# Altium schematic sheet LTC1562 8th order 2 resistors per pin.SchDoc
size B; SheetNumber: 1; SheetTotal: 2
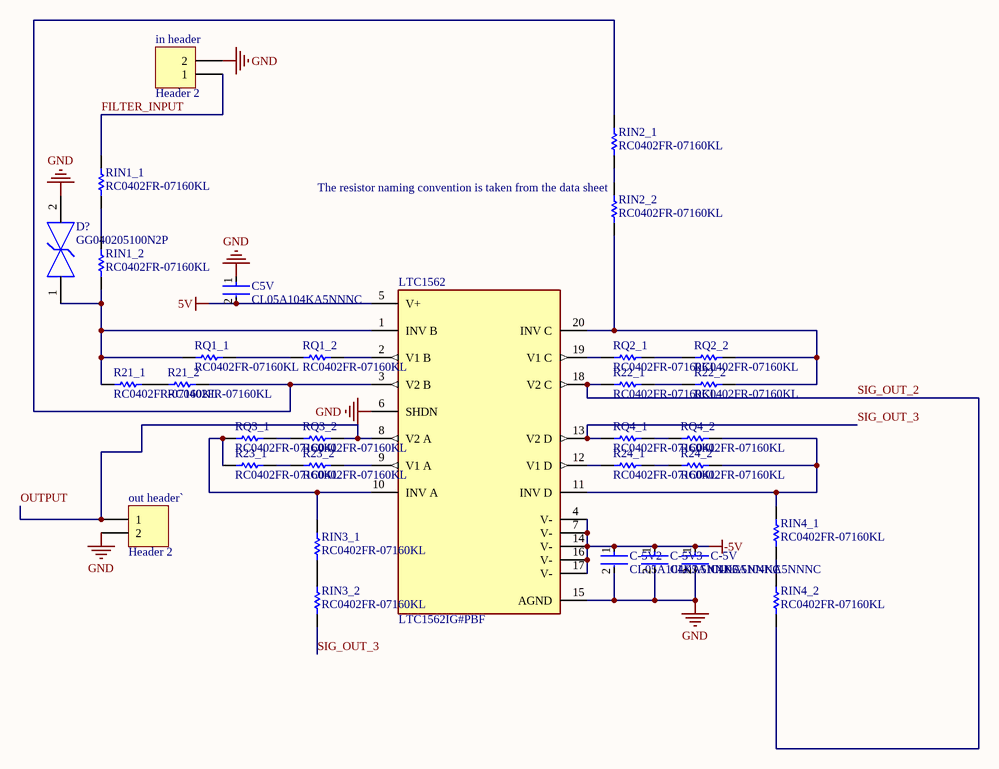
[diagram p0: LTC1562 8th order 2 resistors per pin.SchDoc]

## Parts
C5V  CL05A104KA5NNNC  [FP-CL278-IPC_C]
C-5V  CL05A104KA5NNNC  [FP-CL278-IPC_C]
C-5V2  CL05A104KA5NNNC  [FP-CL278-IPC_C]
C-5V3  CL05A104KA5NNNC  [FP-CL278-IPC_C]
D?  GG040205100N2P  [FP-GG0402-MFG]
in_header  Header 2  [HDR1X2]
LTC1562  LTC1562IG#PBF  [FP-G-20-05-08-1640-MFG]
out_header`  Header 2  [HDR1X2]
R21_1  RC0402FR-07160KL  [RESC1005X40X25NL05T10]
R21_2  RC0402FR-07160KL  [RESC1005X40X25NL05T10]
R22_1  RC0402FR-07160KL  [RESC1005X40X25NL05T10]
R22_2  RC0402FR-07160KL  [RESC1005X40X25NL05T10]
R23_1  RC0402FR-07160KL  [RESC1005X40X25NL05T10]
R23_2  RC0402FR-07160KL  [RESC1005X40X25NL05T10]
R24_1  RC0402FR-07160KL  [RESC1005X40X25NL05T10]
R24_2  RC0402FR-07160KL  [RESC1005X40X25NL05T10]
RIN1_1  RC0402FR-07160KL  [RESC1005X40X25NL05T10]
RIN1_2  RC0402FR-07160KL  [RESC1005X40X25NL05T10]
RIN2_1  RC0402FR-07160KL  [RESC1005X40X25NL05T10]
RIN2_2  RC0402FR-07160KL  [RESC1005X40X25NL05T10]
RIN3_1  RC0402FR-07160KL  [RESC1005X40X25NL05T10]
RIN3_2  RC0402FR-07160KL  [RESC1005X40X25NL05T10]
RIN4_1  RC0402FR-07160KL  [RESC1005X40X25NL05T10]
RIN4_2  RC0402FR-07160KL  [RESC1005X40X25NL05T10]
RQ1_1  RC0402FR-07160KL  [RESC1005X40X25NL05T10]
RQ1_2  RC0402FR-07160KL  [RESC1005X40X25NL05T10]
RQ2_1  RC0402FR-07160KL  [RESC1005X40X25NL05T10]
RQ2_2  RC0402FR-07160KL  [RESC1005X40X25NL05T10]
RQ3_1  RC0402FR-07160KL  [RESC1005X40X25NL05T10]
RQ3_2  RC0402FR-07160KL  [RESC1005X40X25NL05T10]
RQ4_1  RC0402FR-07160KL  [RESC1005X40X25NL05T10]
RQ4_2  RC0402FR-07160KL  [RESC1005X40X25NL05T10]

## Nets
5V: C5V.2 LTC1562.5(V+)
-5V: C-5V.1 C-5V2.1 C-5V3.1 LTC1562.4(V-) LTC1562.7(V-) LTC1562.14(V-) LTC1562.16(V-) LTC1562.17(V-)
GND: C5V.1 C-5V.2 C-5V2.2 C-5V3.2 D?.2(IO_2) in_header.2 LTC1562.6(SHDN) LTC1562.15(AGND) out_header`.2
FILTER_INPUT: in_header.1 RIN1_1.1
OUTPUT: LTC1562.8(V2_A) out_header`.1 RQ3_2.2
SIG_OUT_2: LTC1562.18(V2_C) R22_1.1 RIN4_2.2
SIG_OUT_3: LTC1562.13(V2_D) RIN3_2.2 RQ4_1.1
NetD?_1: D?.1(IO_1) LTC1562.1(INV_B) R21_1.1 RIN1_2.2 RQ1_1.1
NetLTC1562_2: LTC1562.2(V1_B) RQ1_2.2
NetLTC1562_3: LTC1562.3(V2_B) R21_2.2 RIN2_1.1
NetLTC1562_9: LTC1562.9(V1_A) R23_2.2
NetLTC1562_10: LTC1562.10(INV_A) R23_1.1 RIN3_1.1 RQ3_1.1
NetLTC1562_11: LTC1562.11(INV_D) R24_2.2 RIN4_1.1 RQ4_2.2
NetLTC1562_12: LTC1562.12(V1_D) R24_1.1
NetLTC1562_19: LTC1562.19(V1_C) RQ2_1.1
NetLTC1562_20: LTC1562.20(INV_C) R22_2.2 RIN2_2.2 RQ2_2.2
NetR21_1_2: R21_1.2 R21_2.1
NetR22_1_2: R22_1.2 R22_2.1
NetR23_1_2: R23_1.2 R23_2.1
NetR24_1_2: R24_1.2 R24_2.1
NetRIN1_1_2: RIN1_1.2 RIN1_2.1
NetRIN2_1_2: RIN2_1.2 RIN2_2.1
NetRIN3_1_2: RIN3_1.2 RIN3_2.1
NetRIN4_1_2: RIN4_1.2 RIN4_2.1
NetRQ1_1_2: RQ1_1.2 RQ1_2.1
NetRQ2_1_2: RQ2_1.2 RQ2_2.1
NetRQ3_1_2: RQ3_1.2 RQ3_2.1
NetRQ4_1_2: RQ4_1.2 RQ4_2.1

## Notes on the sheet
- (near RIN2_2) The resistor naming convention is taken from the data sheet

## Library data of the parts
C5V C-5V C-5V2 C-5V3 = CMP-13271-000728-1: Cap Ceramic 100nF 25V X5R ±10% SMD 0402 +85°C Paper T/R; Package Quantity: 1; Height: 0.5mm; Case Code (Metric): 1005; Thickness: 0.022inch; Mount: Surface Mount; Lead Free: Lead Free; Case Code (Imperial): 0402; Packaging: Tape and Reel; Depth: 0.5mm; Voltage: 25V; Min Operating Temperature: -55°C; Voltage Rating: 25V; Dielectric: X5R; Case/Package: 0402; Tolerance: 10%; Width: 0.02inch; Max Operating Temperature: 85°C; Capacitance: 100nF; Length: 1mm; Radiation Hardening: No; Voltage Rating (DC): 25V
D? = CMP-04587-000001-1: TVS DIODE 5V 12V 0402; Manufacturer: AVX Corporation; Number Of Channels: 1; Peak Pulse Current: 16A; Capacitance: 10pF; Direction: Bidirectional; Value: 10pF; Breakdown Voltage: 5.5V; Peak Pulse Power: 96W; Automotive: No; ComponentLink2URL: http://datasheets.avx.com/AVX-GiGuard.pdf; Manufacturer Part Number: GG040205100N2P; Lead Free: Yes; Device Class L2: TVS Diodes; Temperature: -55°C to +125°C; Category: Diode; Reverse Standoff Voltage: 5V; Octopart: https://octopart.com/gg040205100n2p-avx-81066081; Clamping Voltage: 12V; Ipc Land Pattern Name: DIOC10060X50; Digikey Description: TVS DIODE 5V 12V 0402; Device Class L3: unset; ComponentLink2Description: Datasheet; Temperature Range Low: -55°C; Temperature Range High: +125°C; Device Class L1: Circuit Protection; Height: 0.55mm; Package: GG0402; RoHS: TRUE
in_header out_header` = Header 2: Header, 2-Pin; LatestRevisionDate: 17-Jul-2002; LatestRevisionNote: Re-released for DXP Platform.; Publisher: Altium Limited
LTC1562 = CMP-09114-000012-1: IC FILTER 150KHZ UNIV 20SSOP; Nominal Supply Current: 19mA; Filter Type: UNIVERSAL; Max Supply Voltage: 10.5V; Number of Circuits: 4; Max Dual Supply Voltage: 5.25V; Min Supply Voltage: 4.75V; Dual Supply Voltage: 5V; Min Dual Supply Voltage: 2.375V; Max Operating Temperature: 85°C; Length: 7.33mm; Width: 5.38mm; Radiation Hardening: No; Lead Free: Lead Free; Series: -; Package Quantity: 66; Number of Pins: 20; RoHS Compliant: Yes; Case/Package: SSOP; Type: Active; Min Operating Temperature: -40°C; Packaging: Rail/Tube; Mount: Surface Mount; Height: 1.78mm; Supply Current: 19mA
R21_1 R21_2 R22_1 R22_2 R23_1 R23_2 R24_1 R24_2 RIN1_1 RIN1_2 RIN2_1 RIN2_2 RIN3_1 RIN3_2 RIN4_1 RIN4_2 RQ1_1 RQ1_2 RQ2_1 RQ2_2 RQ3_1 RQ3_2 RQ4_1 RQ4_2 = CMP-2002-07080-1: Manufacturer: Yageo / Phycomp; Part Number: RC0402FR-07160KL